# Altium schematic sheet Mopq.SchDoc: Band
size Letter; DrawnBy: John Kelley; Organization: Hello Inc.; Address1: L3, 12a Rodborough Rd; Address2: Frenchs Forest; Address3: NSW; Address4: Australia 2086; Revision: EVT2; SheetNumber: 1; SheetTotal: 8
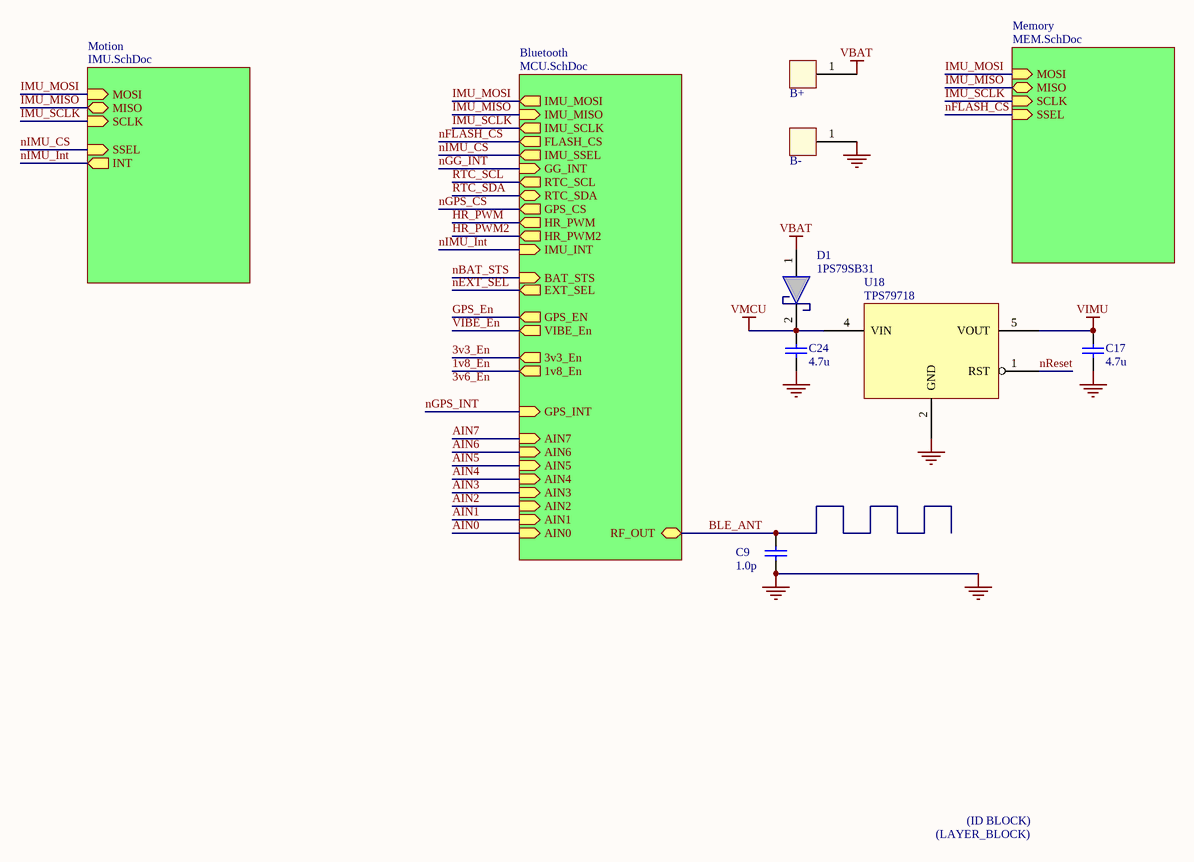
[diagram p0: Mopq.SchDoc]

## Parts
*  LAYER_BLOCK  [Layer Stackup]  (value not drawn)  (no BOM)
B+  5016  [TP0875x050]  (value not drawn)
B-  5016  [TP0875x050]  (value not drawn)
C9  1.0p  [CAP0402]
C17  4.7u  [CAP0402]
C24  4.7u  [CAP0402]
D1  1PS79SB31  [SOD-523]
ID1  ID_BLOCK  [Hello Band]  (value not drawn)  (no BOM)
U18  TPS79718  [SOT65P212X110-5N]

## Sub-sheets
Bluetooth = MCU.SchDoc: IMU_MOSI (out), IMU_MISO (in), IMU_SCLK (out), HR_PWM (out), IMU_SSEL (out), FLASH_CS (out), IMU_INT (in), GPS_CS (out), GPS_EN (out), VIBE_En (out), 3v3_En (out), AIN6 (in), BAT_STS (in), HR_PWM2 (out), GPS_INT (in), GG_INT (in), RTC_SCL (out), RTC_SDA, AIN7 (in), EXT_SEL (out), 1v8_En (out), AIN4 (in), AIN5 (in), AIN2 (in), AIN3 (in), AIN0 (in), AIN1 (in), RF_OUT
Memory = MEM.SchDoc: SSEL (in), MOSI (in), MISO, SCLK (in)
Motion = IMU.SchDoc: MOSI (in), MISO, SCLK (in), INT (out), SSEL (in)

## Nets
GND: B-.1 C9.1 C17.1 C24.1 U18.2(GND)
VBAT: B+.1 D1.1(Anode)
VIMU: C17.2 U18.5(VOUT)
VMCU: C24.2 D1.2(Cathode) U18.4(VIN)
1v8_En: sheet Bluetooth/1v8_En
3v3_En: sheet Bluetooth/3v3_En
AIN0: sheet Bluetooth/AIN0
AIN1: sheet Bluetooth/AIN1
AIN2: sheet Bluetooth/AIN2
AIN3: sheet Bluetooth/AIN3
AIN4: sheet Bluetooth/AIN4
AIN5: sheet Bluetooth/AIN5
AIN6: sheet Bluetooth/AIN6
AIN7: sheet Bluetooth/AIN7
BLE_ANT: C9.2 ; sheet Bluetooth/RF_OUT
GPS_En: sheet Bluetooth/GPS_EN
HR_PWM: sheet Bluetooth/HR_PWM
HR_PWM2: sheet Bluetooth/HR_PWM2
IMU_MISO: sheet Bluetooth/IMU_MISO, sheet Memory/MISO, sheet Motion/MISO
IMU_MOSI: sheet Bluetooth/IMU_MOSI, sheet Memory/MOSI, sheet Motion/MOSI
IMU_SCLK: sheet Bluetooth/IMU_SCLK, sheet Memory/SCLK, sheet Motion/SCLK
nBAT_STS: sheet Bluetooth/BAT_STS
nEXT_SEL: sheet Bluetooth/EXT_SEL
nFLASH_CS: sheet Bluetooth/FLASH_CS, sheet Memory/SSEL
nGG_INT: sheet Bluetooth/GG_INT
nGPS_CS: sheet Bluetooth/GPS_CS
nGPS_INT: sheet Bluetooth/GPS_INT
nIMU_CS: sheet Bluetooth/IMU_SSEL, sheet Motion/SSEL
nIMU_Int: sheet Bluetooth/IMU_INT, sheet Motion/INT
nReset: U18.1(RST)
RTC_SCL: sheet Bluetooth/RTC_SCL
RTC_SDA: sheet Bluetooth/RTC_SDA
VIBE_En: sheet Bluetooth/VIBE_En

## Notes on the sheet
- Labels drawn without touching a wire or pin: 3v6_En
- TITLE
- DATE
- DRAWN BY
- REV
- SHEET
- OF
- (in symbol ID_BLOCK) (ID BLOCK)
- (in symbol LAYER_BLOCK) (LAYER_BLOCK)

## Library data of the parts
B+ B- = 5016: Single-pad test point
C9 = C_2200p_5_16_STD_0402: Chip capacitor; Vendor: Taiyo Yuden; PN: EMK100SD222JV-F; Tolerance: 5 %; Voltage: 16V; Temp: Standard; Value: 1.0p; Size: 0402
C17 C24 = C_4.7u_10_10_JB_0402: Chip capacitor; Vendor: TDK; PN: C1005JB1A475K050BC; Tolerance: 10%; Voltage: 10V; Temp: JB; Value: 4.7u; Size: 0402
D1 = 1PS79SB31: Schottky diode, 30V 200mA; Vendor: NXP; PN: 1PS79SB31
U18 = TPS79718DCK: LDO 1.8V SC70-5